# Altium schematic sheet LCD_Sheet.SchDoc
size A; SheetNumber: 6; SheetTotal: 6
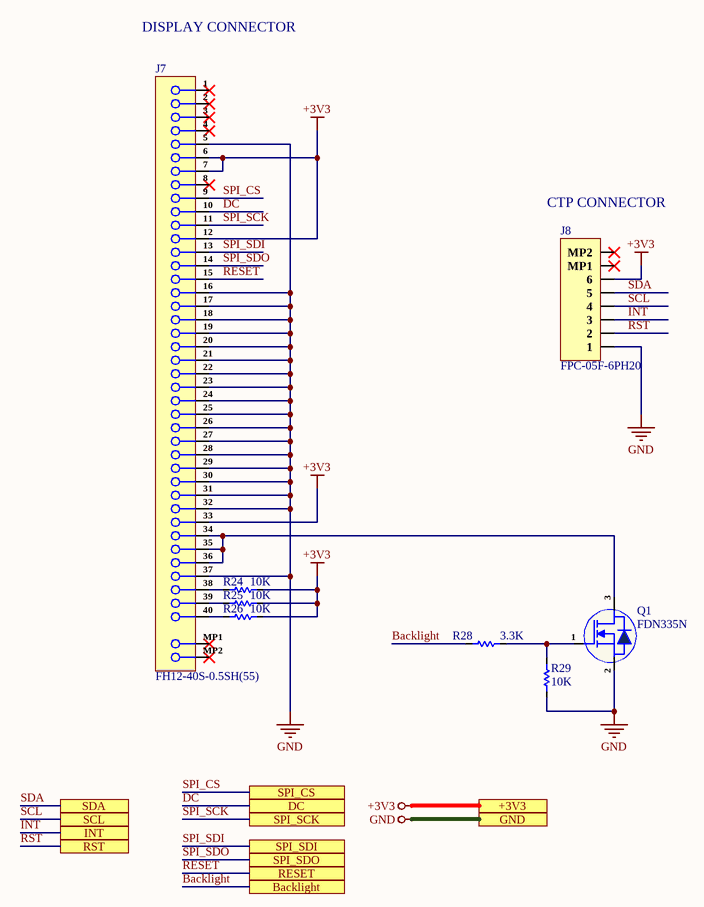
[diagram p0: LCD_Sheet.SchDoc]

## Parts
J7  FH12-40S-0.5SH(55)  [FH12-40S-0.5SH(55)]
J8  FPC-05F-6PH20  [FPC-05F-6PH20]
Q1  FDN335N  [SOT-23]
R24  10K  [Res-0603]
R25  10K  [Res-0603]
R26  10K  [Res-0603]
R28  3.3K  [Res-0603]
R29  10K  [Res-0603]

## Ports
+3V3 (see Top_Sheet[3C], Amplifier_Sheet[3D], Controller_Sheet[3D], Power_Sheet[3D], Sensor_Sheet[3D]), Backlight (see Top_Sheet[3C], Controller_Sheet[3D]), DC (see Top_Sheet[3C], Controller_Sheet[3D]), GND (see Top_Sheet[3C], Amplifier_Sheet[3D], Controller_Sheet[3D], Power_Sheet[3D], Sensor_Sheet[3D]), INT (see Top_Sheet[4C], Controller_Sheet[1D]), RESET (see Top_Sheet[3C], Controller_Sheet[3D]), RST (see Top_Sheet[4C], Controller_Sheet[1D]), SCL (see Top_Sheet[4C], Amplifier_Sheet[2D], Controller_Sheet[1D], Sensor_Sheet[2D]), SDA (see Top_Sheet[4C], Amplifier_Sheet[2D], Controller_Sheet[1D], Sensor_Sheet[2D]), SPI_CS (see Top_Sheet[3C], Controller_Sheet[3C]), SPI_SCK (see Top_Sheet[3C], Controller_Sheet[3D]), SPI_SDI (see Top_Sheet[3C], Controller_Sheet[3D]), SPI_SDO (see Top_Sheet[3C], Controller_Sheet[3D])

## Nets
+3V3: J7.6 J7.7 J7.12 J7.33 J8.6 R24.2 R25.2 R26.2 ; port +3V3
GND: J7.5 J7.16 J7.17 J7.18 J7.19 J7.20 J7.21 J7.22 J7.23 J7.24 J7.25 J7.26 J7.27 J7.28 J7.29 J7.30 J7.31 J7.32 J7.37 J8.1 Q1.2(S) R29.1 ; port GND
Backlight: R28.1 ; port Backlight
DC: J7.10 ; port DC
INT: J8.3 ; port INT
RESET: J7.15 ; port RESET
RST: J8.2 ; port RST
SCL: J8.4 ; port SCL
SDA: J8.5 ; port SDA
SPI_CS: J7.9 ; port SPI_CS
SPI_SCK: J7.11 ; port SPI_SCK
SPI_SDI: J7.13 ; port SPI_SDI
SPI_SDO: J7.14 ; port SPI_SDO
NetJ7_34: J7.34 J7.35 J7.36 Q1.3(D)
NetJ7_38: J7.38 R24.1
NetJ7_39: J7.39 R25.1
NetJ7_40: J7.40 R26.1
NetQ1_1: Q1.1(G) R28.2 R29.2

Not connected (* = marked no-connect by the designer): J7 1* 2* 3* 4* 8* MP1* MP2*; J8 MP1* MP2*

## Notes on the sheet
- DISPLAY CONNECTOR
- (near J8) CTP CONNECTOR

## Library data of the parts
J7 = FH12-40S-0.5SH(55): CONN FFC BOTTOM 40POS 0.50MM R/A; Manufacturer: Hirose; Connector Type: CARD EDGE CONNECTOR; Option: General Purpose; Filter Feature: No; Number of Rows Loaded: 1; Number of Contacts: 40; Contact Pattern: RECTANGULAR; Contact Resistance: 50mR; Contact Style: BELLOWED TYPE; Dielectric Withstanding Voltage (AC): 150V; Durability: 20Cycles; Insulation Resistance: 500MR; Rated Current (Signal): 400mA; Body Breadth: 0.079inch; Body Depth: 0.22inch; Body Length: 0.949inch; Mating Contact Pitch: 0.02inch; Mounting Option 1: EJECT LEVER; Mounting Option 2: LOCKING; Reference Standard: UL; Reliability: COMMERCIAL; Item Type: Connector; Supplier 1: Digi-Key; Manufacturer Part Number: FH12-40S-0.5SH(55); RoHS: Yes; Category: FFC / FPC; Stock 1: 11247; Pricing 1: 1=3.00000, 10=2.72800, 25=2.58400, 50=2.52400, 100=2.40380, 250=2.10332, 500=2.04324, 1000=1.74276 (USD); Mounting Technology: Board; Contact Finish - Mating: NOT SPECIFIED; Contact Finish - Termination: Nickel/Gold (Ni/Au); Insulation Color: Beige; Insulation Material: Polyamide; Min Operating Temperature: -40°C; Max Operating Temperature: 70°C; JESD-609 Code: e4; Contact Gender: Female; Mixed Contacts: No; Mounting Style: RIGHT ANGLE; Termination: SMD/SMT; Number Of PCB Rows: 1; PCB Contact Pattern: RECTANGULAR; Terminal Pitch: 0.5mm; Flammability Rating: UL94 V-0; RoHS Compliant: Yes; DIN Conformance: No; IEC Conformance: No; MIL Conformance: No; Reach SVHC Compliant: Yes; ComponentLink1URL: https://datasheet.ciiva.com:443/pdfs/VipMasterIC/IC/HIRO/HIRO-S-A0003089604/HIRO-S-A0008599618-1.pdf?src-supplier=IHS+Markit; ComponentLink1Description: https://datasheet.ciiva.com:443/pdfs/VipMasterIC/IC/HIRO/HIRO-S-A0003089604/HIRO-S-A0008599618-1.pdf?src-supplier=IHS+Markit; ComponentLink2URL: https://datasheet.ciiva.com/11745/0900766b80d985fc-11745617.pdf?src-supplier=RSComponents; ComponentLink2Description: https://datasheet.ciiva.com/11745/0900766b80d985fc-11745617.pdf?src-supplier=RSComponents; ComponentLink3URL: https://datasheet.ciiva.com/15176/getdatasheetpartid-432539-15176843.pdf?src-supplier=Verical; ComponentLink3Description: https://datasheet.ciiva.com/15176/getdatasheetpartid-432539-15176843.pdf?src-supplier=Verical; ComponentLink4URL: https://datasheet.ciiva.com/7661/58803-7661389.pdf?src-supplier=Element14; ComponentLink4Description: https://datasheet.ciiva.com/7661/58803-7661389.pdf?src-supplier=Element14; Supplier Part Number 1: 26-FH12-40S-0.5SH(55)CT-ND; LCSC Part Number: C202114
J8 = FPC-05F-6PH20: Clamshell -25℃~+85℃ 6P Bottom Contact Surface Mount，Right Angle 0.5mm SMD,P=0.5mm,Surface Mount，Right Angle FFC/FPC Connectors ROHS; Manufacturer: XUNPU; Item Type: FPC; Manufacturer Part Number: FPC-05F-6PH20; LCSC Part Number: C2856796; Package: SMD,P=0.5mm; ComponentLink1Description: LCSC Link; ComponentLink1URL: https://www.lcsc.com/product-detail/FFC-FPC-Connectors_XUNPU-FPC-05F-6PH20_C2856796.html
Q1 = FDN335N: SOT-23 MOSFETs ROHS; Manufacturer: TECH PUBLIC; Item Type: Mosfet; Manufacturer Part Number: FDN335N; Package: SOT-23; LCSC Part Number: C5123904; ComponentLink1Description: LCSC; ComponentLink1URL: https://www.lcsc.com/product-detail/MOSFETs_TECH-PUBLIC-FDN335N_C5123904.html
R24-R26 R29 = RT0603BRD0710KL: RES SMD 10K OHM 0.1% 1/10W 0603; Manufacturer: Yageo; Power: 100mW; Rated Temperature: 70°C; Value: 10kR; Temperature Coefficient: 25ppm/°C; Working Voltage: 75V; Package Height: 0.45mm; Package Length: 1.6mm; Package Width: 0.8mm; Item Type: Resistor; Supplier 1: Rs; Manufacturer Part Number: RT0603BRD0710KL; RoHS: Yes; Category: Chip SMD Resistors; Stock 1: 20510; Pricing 1: 100=0.29800, 250=0.27800, 500=0.25900, 1000=0.23700 (GBP); Mounting Technology: Surface Mount; Pins: 2; Case/Package: 0603; Min Operating Temperature: -55°C; Max Operating Temperature: 155°C; Tolerance: 0.1%; Resistor Type: FIXED RESISTOR; Construction: Chip; Package Style: SMTMeter; Packaging: Tape and Reel; Technology: THIN FILM; Termination: Wraparound; Reach SVHC Compliant: Yes; RoHS Compliant: Yes; ComponentLink1URL: https://datasheet.ciiva.com:443/pdfs/VipMasterIC/IC/YAGO/YAGO-S-A0008510989/YAGO-S-A0008510989-1.pdf?src-supplier=IHS+Markit; ComponentLink1Description: https://datasheet.ciiva.com:443/pdfs/VipMasterIC/IC/YAGO/YAGO-S-A0008510989/YAGO-S-A0008510989-1.pdf?src-supplier=IHS+Markit; ComponentLink2URL: https://datasheet.ciiva.com/5624/pyu-rt-1-to-0-05-rohs-l-4-5624351.pdf?src-supplier=Mouser; ComponentLink2Description: https://datasheet.ciiva.com/5624/pyu-rt-1-to-0-05-rohs-l-4-5624351.pdf?src-supplier=Mouser; ComponentLink3URL: https://datasheet.ciiva.com/29721/pyu-rt-1-to-0-05-rohs-l-4-29721177.pdf?src-supplier=Digi-Key; ComponentLink3Description: https://datasheet.ciiva.com/29721/pyu-rt-1-to-0-05-rohs-l-4-29721177.pdf?src-supplier=Digi-Key; Supplier Part Number 1: 1991391P; LCSC Part Number: C95204
R28 = 0603WAF3301T5E: 100mW Thick Film Resistors 75V ±100ppm/℃ ±1% 3.3kΩ 0603 Chip Resistor - Surface Mount ROHS; Manufacturer: UNI-ROYAL(Uniroyal Elec); Manufacturer Part Number: 0603WAF3301T5E; LCSC Part Number: C22978; Item Type: Resistor; Package: 0603; ComponentLink1Description: LSCS Link; ComponentLink1URL: https://www.lcsc.com/product-detail/Chip-Resistor-Surface-Mount_UNI-ROYAL-Uniroyal-Elec-0603WAF3301T5E_C22978.html